# Altium project GANDHVEDH_Ammonia.PrjPcb
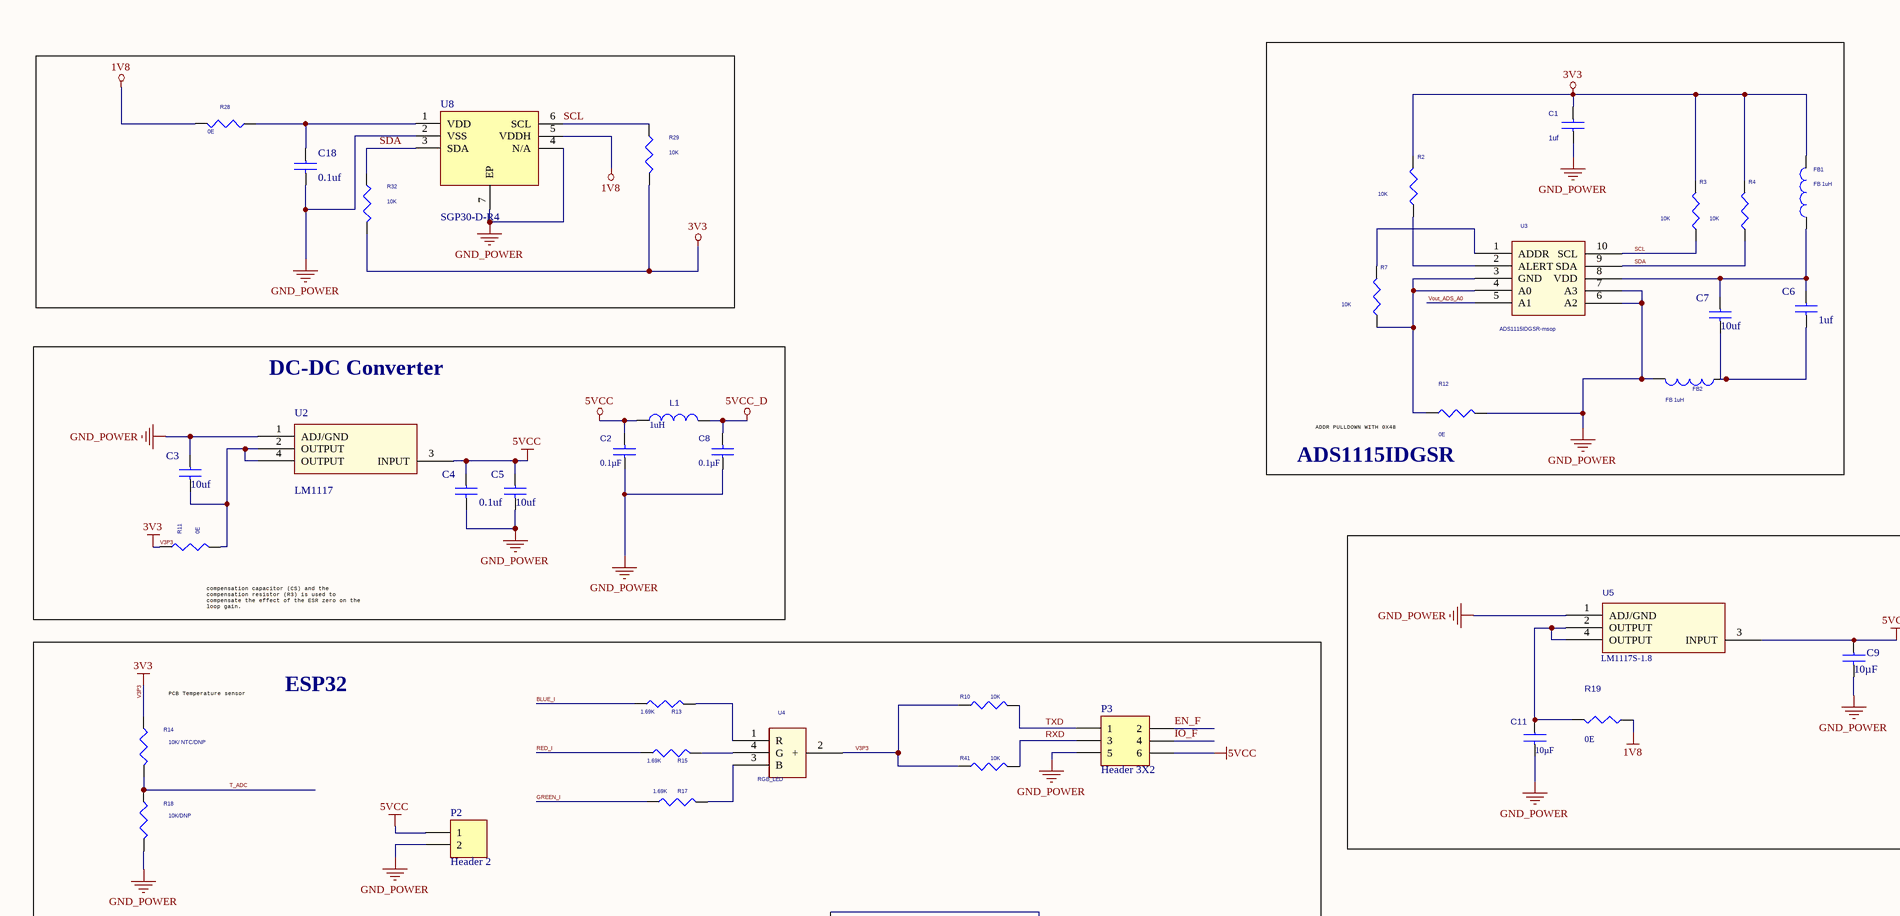
[diagram p0: GANDHVEDH_Ammonia.SchDoc, top left]
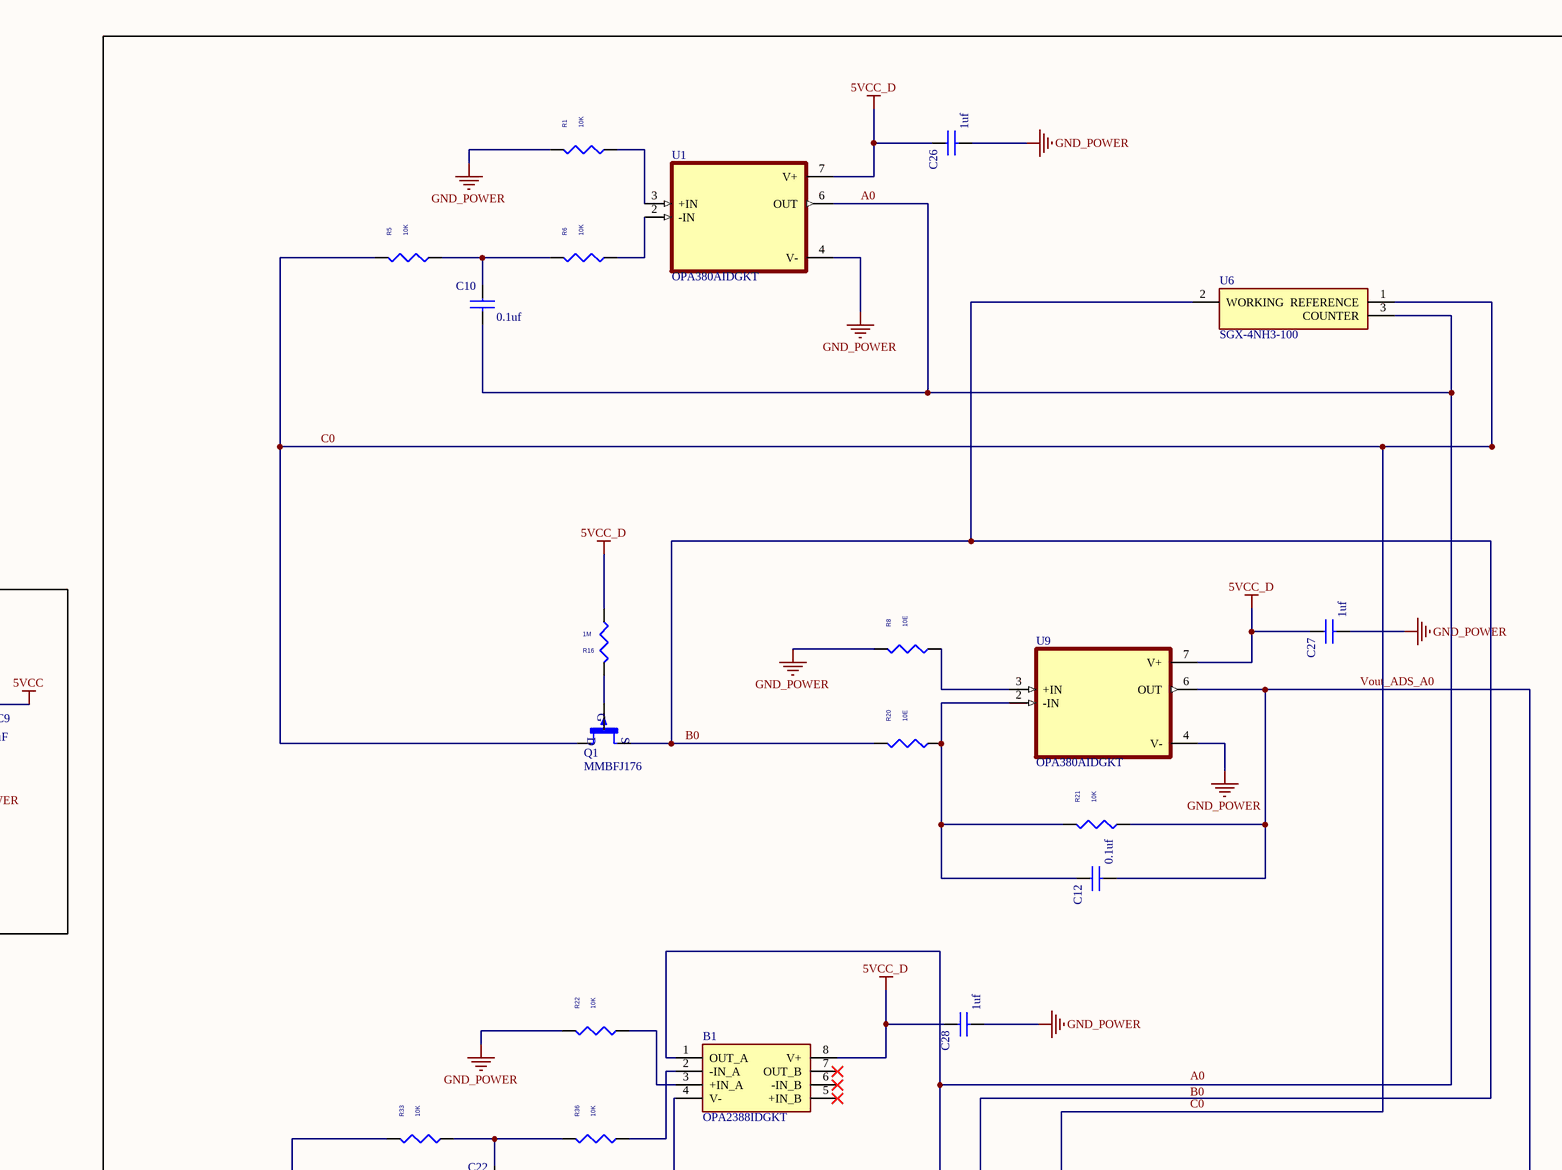
[diagram p1: GANDHVEDH_Ammonia.SchDoc, top right]
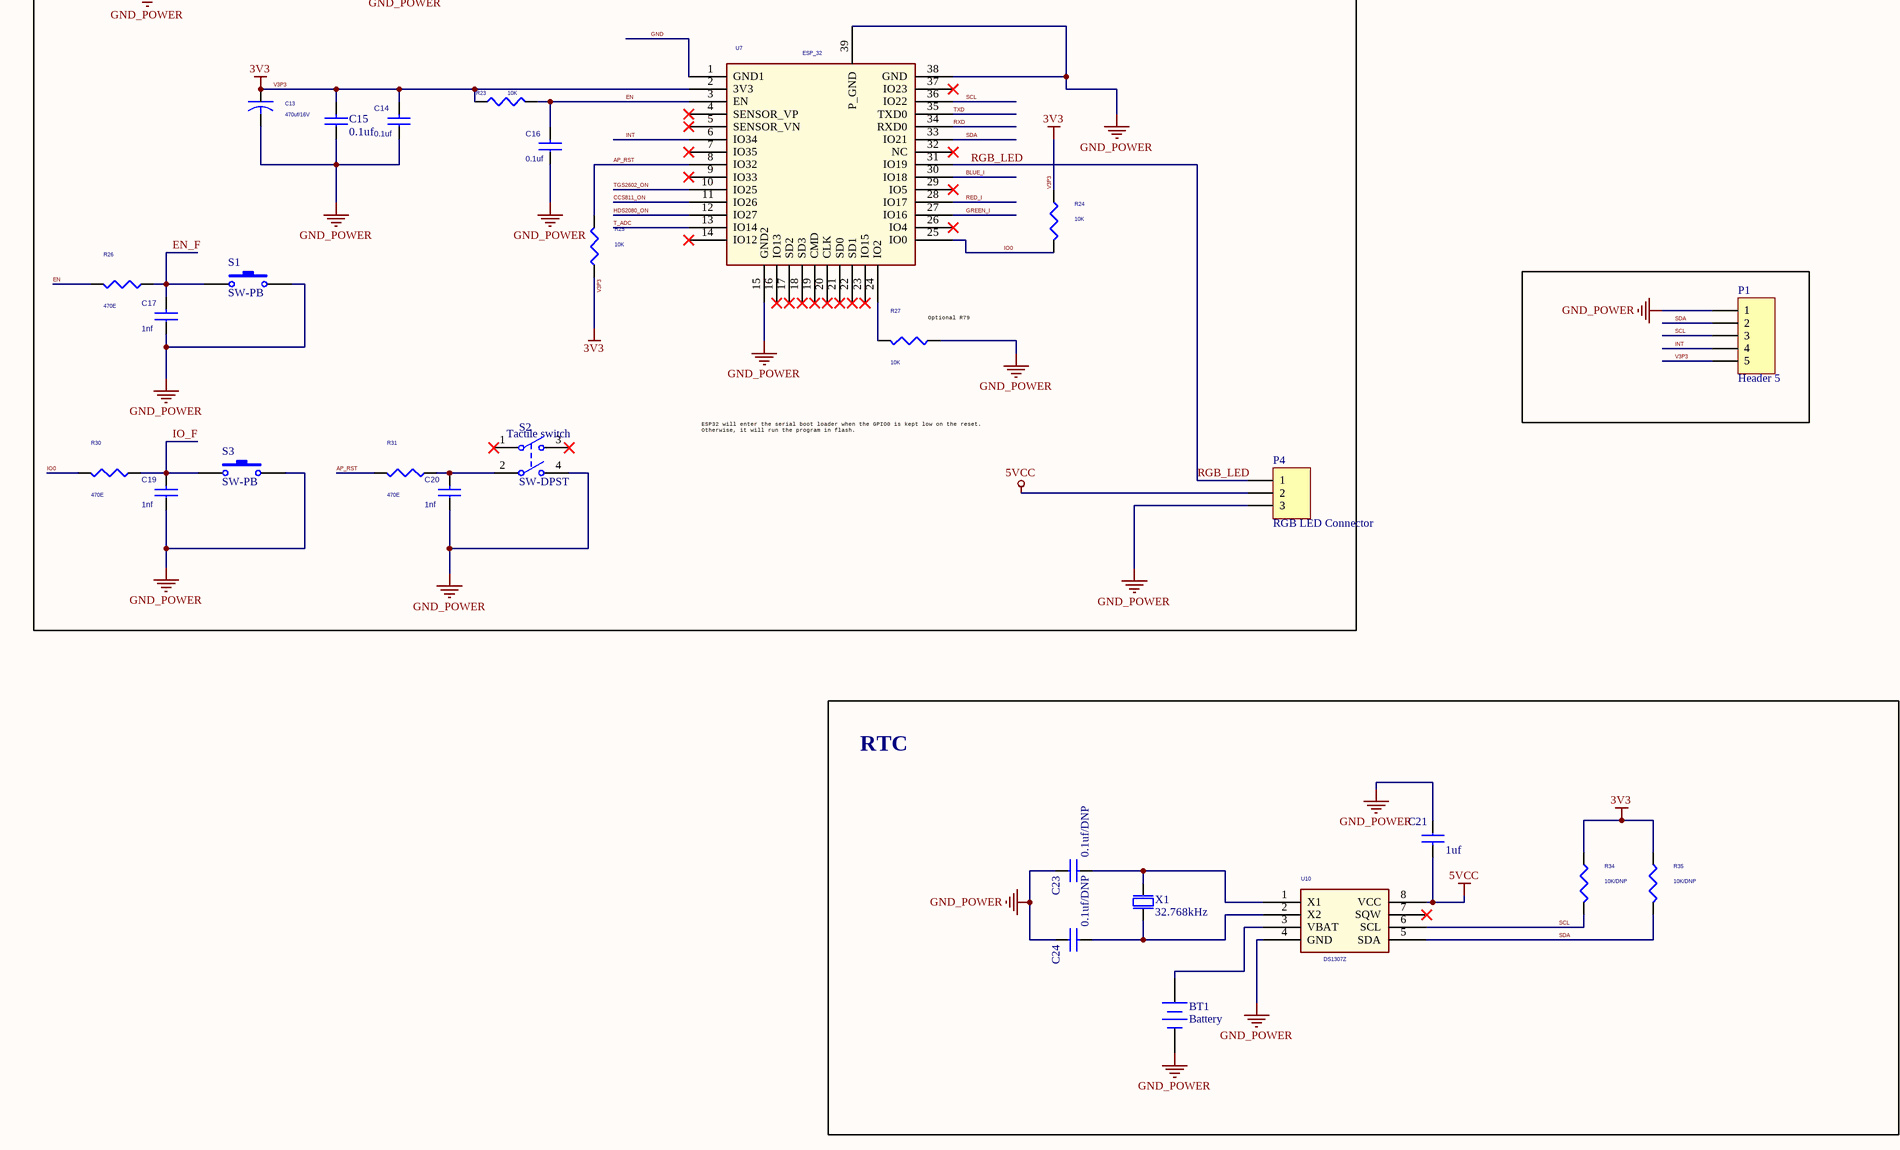
[diagram p2: GANDHVEDH_Ammonia.SchDoc, bottom left]
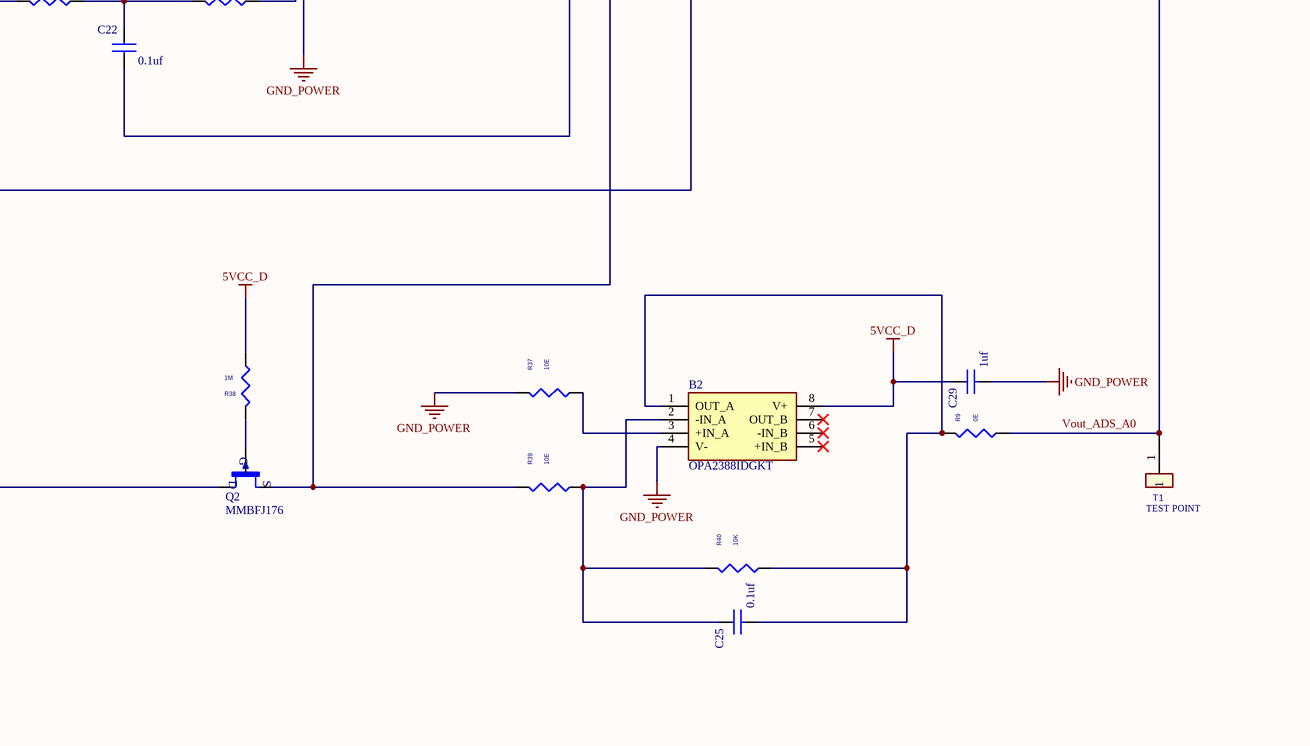
[diagram p3: GANDHVEDH_Ammonia.SchDoc, bottom right]
1 sheet, 97 parts. Net scope: global (net labels, ports and power ports of the same name join across sheets).
Board file: GANDHVEDH_Ammonia.PcbDoc

## Sheet GANDHVEDH_Ammonia.SchDoc
size D

### Parts
B1  OPA2388IDGKT  [SOP65P490X110-8N]
B2  OPA2388IDGKT  [SOP65P490X110-8N]
BT1  Battery  [MPD_BK-912-TR]
C1  1uf  [C0603]
C2  0.1µF  [C0603]
C3  10uf  [C0603]
C4  0.1uf  [C0603]
C5  10uf  [C0603]
C6  1uf  [C0603]
C7  10uf  [C0603]
C8  0.1µF  [C0603]
C9  10µF  [R0603]
C10  0.1uf  [C0603]
C11  10µF  [C0603]
C12  0.1uf  [C0603]
C13  470uf/16V  [C16, C49, C58]
C14  0.1uf  [C0603]
C15  0.1uf  [C0603]
C16  0.1uf  [C0603]
C17  1nf  [C0603]
C18  0.1uf  [C0603]
C19  1nf  [C0603]
C20  1nf  [C0603]
C21  1uf  [C0603]
C22  0.1uf  [C0603]
C23  0.1uf/DNP  [C0603]
C24  0.1uf/DNP  [C0603]
C25  0.1uf  [C0603]
C26  1uf  [C0603]
C27  1uf  [C0603]
C28  1uf  [C0603]
C29  1uf  [C0603]
FB1  FB 1uH  [C0603]
FB2  FB 1uH  [C0603]
L1  1uH  [L3, L4, L5, L6, L7]
P1  Header 5  [J2]
P2  Header 2  [HDR1X2]
P3  Header 3X2  [P5 - new]
P4  RGB LED Connector  [P6]
Q1  MMBFJ176  [SOT23]
Q2  MMBFJ176  [SOT23]
R1  10K  [R0603]
R2  10K  [R0603]
R3  10K  [R0603]
R4  10K  [R0603]
R5  10K  [R0603]
R6  10K  [R0603]
R7  10K  [R0603]
R8  10E  [R0603]
R9  0E  [R0603]
R10  10K  [R_0603_W]
R11  0E  [R0603]
R12  0E  [R0603]
R13  1.69K  [R0603]
R14  10K/ NTC/DNP  [R0603]
R15  1.69K  [R0603]
R16  1M  [R0603]
R17  1.69K  [R0603]
R18  10K/DNP  [R0603]
R19  0E  [R0603]
R20  10E  [R0603]
R21  10K  [R0603]
R22  10K  [R0603]
R23  10K  [R0603]
R24  10K  [R0603]
R25  10K  [R0603]
R26  470E  [R0603]
R27  10K  [R0603]
R28  0E  [R0603]
R29  10K  [R0603]
R30  470E  [R0603]
R31  470E  [R0603]
R32  10K  [R0603]
R33  10K  [R0603]
R34  10K/DNP  [R0603]
R35  10K/DNP  [R0603]
R36  10K  [R0603]
R37  10E  [R0603]
R38  1M  [R0603]
R39  10E  [R0603]
R40  10K  [R0603]
R41  10K  [R_0603_W]
S1  SW-PB  [*TE_FSMSM]
S2  SW-DPST  [PCBComponent_1 - duplicate]
S3  SW-PB  [*TE_FSMSM]
T1  TEST POINT  [TP]
U1  OPA380AIDGKT  [SOP65P490X110-8N]
U2  LM1117  [U1, U24              SOT-223]
U3  ADS1115IDGSR-msop  [U19, U20]
U4  RGB_LED  [WL-SFCW_1206]
U5  LM1117S-1.8  [U1, U24              SOT-223]
U6  SGX-4NH3-100  [SGX4NH3100]
U7  ESP_32  [U20             ESP 32]
U8  SGP30-D-R4  [XCDR_SGP40-D-R4]
U9  OPA380AIDGKT  [SOP65P490X110-8N]
U10  DS1307Z  [U14               SOIC-8N]
X1  32.768kHz  [XTAL_ECS-.327-12.5-13FLX-C]

### Blocks framed on the sheet
ADS1115IDGSR: C1 C6 C7 FB1 FB2 R2-R4 R7 R12 U3
DC-DC Converter: C2-C5 C8 L1 R11 U2
ESP32: C13-C17 C19 C20 P2-P4 R10 R13-R15 R17 R18 R23-R27 R30 R31 R41 S1-S3 U4 U7
RTC: BT1 C21 C23 C24 R34 R35 U10 X1

### Nets
1V8: R19.1 R28.2 U8.5(VDDH)
5VCC: C2.2 C4.1 C5.1 C9.1 C21.2 L1.1 P2.1 P3.6 P4.2 U2.3(INPUT) U5.3(INPUT) U10.8(VCC)
5VCC_D: B1.8(V+) B2.8(V+) C8.2 C26.1 C27.1 C28.1 C29.1 L1.2 R16.1 R38.1 U1.7(V+) U9.7(V+)
GND_POWER: B1.4(V-) B2.4(V-) BT1.2(-) C1.1 C2.1 C3.1 C4.2 C5.2 C8.1 C9.2 C11.2 C13.2 C14.1 C15.1 C16.1 C17.1 C18.2 C19.1 C20.1 C21.1 C23.1 C24.1 C26.2 C27.2 C28.2 C29.2 FB2.2 P1.1 P2.2 P3.5 P4.3 R1.2 R8.2 R12.2 R18.2 R22.2 R27.1 R37.2 S1.2 S2.4(NO2) S3.2 U1.4(V-) U2.1(ADJ/GND) U3.6(A2) U3.7(A3) U5.1(ADJ/GND) U7.15(GND2) U7.38(GND) U7.39(P_GND) U8.2(VSS) U8.4(N/A) U8.7(EP) U9.4(V-) U10.4(GND)
V3P3: C1.2 C13.1 C14.2 C15.2 FB1.2 P1.5 R2.1 R3.1 R4.1 R10.1 R11.1 R14.1 R23.1 R24.1 R25.1 R29.2 R32.2 R34.1 R35.1 R41.1 U4.2(+) U7.2(3V3)  [also labelled 3V3]
A0: B1.1(OUT_A) C10.2 C22.2 U1.6(OUT) U6.3(COUNTER)
AP_RST: R25.2 R31.2 U7.8(IO32)
B0: Q1.2(S) Q2.2(S) R20.2 R39.2 U6.2(WORKING)
BLUE_I: R13.1 U7.30(IO18)
C0: Q1.1(D) Q2.1(D) R5.2 R33.2 U6.1(REFERENCE)
CCS811_ON: U7.11(IO26)
EN: C16.2 R23.2 R26.2 U7.3(EN)
EN_F: C17.2 P3.2 R26.1 S1.1
GND: U7.1(GND1)
GREEN_I: R17.1 U7.27(IO16)
HDS2080_ON: U7.12(IO27)
INT: P1.4 U7.6(IO34)
IO0: R24.2 R30.2 U7.25(IO0)
IO_F: C19.2 P3.4 R30.1 S3.1
RED_I: R15.1 U7.28(IO17)
RGB_LED: P4.1 U7.31(IO19)
RXD: P3.3 R41.2 U7.34(RXD0)
SCL: P1.3 R3.2 R29.1 R34.2 U3.10(SCL) U7.36(IO22) U8.6(SCL) U10.6(SCL)
SDA: P1.2 R4.2 R32.1 R35.2 U3.9(SDA) U7.33(IO21) U8.3(SDA) U10.5(SDA)
T_ADC: R14.2 R18.1 U7.13(IO14)
TGS2602_ON: U7.10(IO25)
TXD: P3.1 R10.2 U7.35(TXD0)
Vout_ADS_A0: C12.2 R9.1 R21.1 T1.1 U3.5(A1) U9.6(OUT)
NetB1_2: B1.2(-IN_A) R36.1
NetB1_3: B1.3(+IN_A) R22.1
NetB2_1: B2.1(OUT_A) C25.2 R9.2 R40.1
NetB2_2: B2.2(-IN_A) C25.1 R39.1 R40.2
NetB2_3: B2.3(+IN_A) R37.1
NetBT1_1: BT1.1(+) U10.3(VBAT)
NetC3_2: C3.2 R11.2 U2.2(OUTPUT) U2.4(OUTPUT)
NetC6_1: C6.1 C7.1 FB1.1 U3.8(VDD)
NetC6_2: C6.2 C7.2 FB2.1
NetC10_1: C10.1 R5.1 R6.2
NetC11_1: C11.1 R19.2 U5.2(OUTPUT) U5.4(OUTPUT)
NetC12_1: C12.1 R20.1 R21.2 U9.2(-IN)
NetC18_1: C18.1 R28.1 U8.1(VDD)
NetC20_2: C20.2 R31.1 S2.2(COMMON2)
NetC22_1: C22.1 R33.1 R36.2
NetC23_2: C23.2 U10.1(X1) X1.1(inp)
NetC24_2: C24.2 U10.2(X2) X1.2(out)
NetQ1_3: Q1.3(G) R16.2
NetQ2_3: Q2.3(G) R38.2
NetR1_1: R1.1 U1.3(+IN)
NetR2_2: R2.2 U3.2(ALERT)
NetR6_1: R6.1 U1.2(-IN)
NetR7_1: R7.1 U3.1(ADDR)
NetR7_2: R7.2 R12.1 U3.3(GND) U3.4(A0)
NetR8_1: R8.1 U9.3(+IN)
NetR13_2: R13.2 U4.1(R)
NetR15_2: R15.2 U4.4(G)
NetR17_2: R17.2 U4.3(B)
NetR27_2: R27.2 U7.24(IO2)

Not connected (* = marked no-connect by the designer): B1 5(+IN_B)* 6(-IN_B)* 7(OUT_B)*; B2 5(+IN_B)* 6(-IN_B)* 7(OUT_B)*; S2 1(COMMON1)* 3(NO1)*; U7 4(SENSOR_VP)* 5(SENSOR_VN)* 7(IO35)* 9(IO33)* 14(IO12)* 16(IO13)* 17(SD2)* 18(SD3)* 19(CMD)* 20(CLK)* 21(SD0)* 22(SD1)* 23(IO15)* 26(IO4)* 29(IO5)* 32(NC)* 37(IO23)*; U10 7(SQW)*

### Notes on the sheet
- ADDR PULLDOWN WITH 0X48
- (near R11) compensation capacitor (CS) and the
  compensation resistor (R3) is used to
  compensate the effect of the ESR zero on the
  loop gain.
- (near R14) PCB Temperature sensor
- (near R27) Optional R79
- (near S2) Tactile switch
- ESP32 will enter the serial boot loader when the GPIO0 is kept low on the reset.
  Otherwise, it will run the program in flash.
- Labels drawn without touching a wire or pin: A0, B0, RGB_LED, Vout_ADS_A0
- Title
- Size:
- Date:
- File:
- D
- Number:
- Time:
- Revision:
- Sheet
- of

### Library data of the parts
B1 B2 = OPA2388IDGKT: 10MHz, CMOS, Zero-Drift, Zero-Crossover, True RRIO Precision Operational Amplifier; Manufacturer_Name: Texas Instruments; Geometry.Height: 1.1mm; Manufacturer_Part_Number: OPA2388IDGKT; Mouser Part Number: 595-OPA2388IDGKT; Mouser Price/Stock: https://www.mouser.co.uk/ProductDetail/Texas-Instruments/OPA2388IDGKT?qs=w%2Fv1CP2dgqqFmz4GVbS77Q%3D%3D; Arrow Part Number: OPA2388IDGKT; Arrow Price/Stock: https://www.arrow.com/en/products/opa2388idgkt/texas-instruments?region=nac; Datasheet Link: http://www.ti.com/general/docs/suppproductinfo.tsp?distId=10&gotoUrl=http%3A%2F%2Fwww.ti.com%2Flit%2Fgpn%2Fopa2388
BT1 = Battery: Multicell Battery; Published: 24-Mar-1999; LatestRevisionDate: 17-Jul-2002; LatestRevisionNote: Re-released for DXP Platform.; PackageReference: BAT-2; Publisher: Altium Limited; PackageDescription: Battery; 2 Leads
C1 = CAP_C_0.1µF/16V: CAP CER SMD 0.1µF/16V; Manufacturer: Murata Electronics North America; Manufacturer Part Number: GRM155R61H104KE19D; Capacitance: 1µF; Tolerance: ±10%; Voltage - Rated: 16V; Temperature Coefficient: X5R; Supplier 1: Digi-Key; Supplier Part Number 1: 490-11917-1-ND; RoHS: RoHS Compliant; Category: Capacitors; Stock 1: 958509; Pricing 1: 1=0.1, 10=0.062, 25=0.0456, 50=0.034, 100=0.0278, 250=0.02328, 500=0.01988, 1000=0.01562, 5000=0.01307 (USD); Packaging: Cut Tape (CT); Part Status: Active; Operating Temperature: -55°C ~ 85°C; Features: -; Ratings: -; Applications: General Purpose; Mounting Type: Surface Mount, MLCC; Package / Case: 0402 (1005 Metric); Size / Dimension: 0.039" L x 0.020" W (1.00mm x 0.50mm); Height - Seated (Max): -; Thickness (Max): 0.022" (0.55mm); Lead Spacing: -; Lead Style: -; ComponentLink1URL: http://www.murata.com/~/media/webrenewal/support/library/catalog/products/capacitor/mlcc/c02e.ashx; ComponentLink1Description: http://www.murata.com/~/media/webrenewal/support/library/catalog/products/capacitor/mlcc/c02e.ashx
C2 C8 C17 C19 C20 = CAP_C_0.1µF/16V: CAP CER SMD 0.1µF/16V; Manufacturer: Murata Electronics North America; Manufacturer Part Number: GRM155R61H104KE19D; Tolerance: ±10%; Voltage - Rated: 16V; Temperature Coefficient: X5R; Supplier 1: Digi-Key; Supplier Part Number 1: 490-11917-1-ND; RoHS: RoHS Compliant; Category: Capacitors; Stock 1: 958509; Pricing 1: 1=0.1, 10=0.062, 25=0.0456, 50=0.034, 100=0.0278, 250=0.02328, 500=0.01988, 1000=0.01562, 5000=0.01307 (USD); Packaging: Cut Tape (CT); Part Status: Active; Operating Temperature: -55°C ~ 85°C; Features: -; Ratings: -; Applications: General Purpose; Mounting Type: Surface Mount, MLCC; Package / Case: 0402 (1005 Metric); Size / Dimension: 0.039" L x 0.020" W (1.00mm x 0.50mm); Height - Seated (Max): -; Thickness (Max): 0.022" (0.55mm); Lead Spacing: -; Lead Style: -; ComponentLink1URL: http://www.murata.com/~/media/webrenewal/support/library/catalog/products/capacitor/mlcc/c02e.ashx; ComponentLink1Description: http://www.murata.com/~/media/webrenewal/support/library/catalog/products/capacitor/mlcc/c02e.ashx
  C2 C8: Capacitance: 0.1µF
  C17 C19 C20: Capacitance: 1nF
C3 C5 C7 = CAP_C_10µF/35V: CAP CER SMD 10µF/35V; Manufacturer: Taiyo Yuden; Manufacturer Part Number: GMK316AB7106KL-TR; Capacitance: 10µF; Tolerance: ±10%; Voltage - Rated: 35V; Temperature Coefficient: X7R; Supplier 1: Digi-Key; Supplier Part Number 1: 587-3007-1-ND; RoHS: RoHS Compliant; Category: Capacitors; Stock 1: 533940; Pricing 1: 1=0.51, 10=0.362, 25=0.3092, 50=0.274, 100=0.2387, 250=0.20328, 500=0.17678, 1000=0.15026 (USD); Packaging: Cut Tape (CT); Part Status: Active; Operating Temperature: -55°C ~ 125°C; Features: -; Ratings: -; Applications: General Purpose; Mounting Type: Surface Mount, MLCC; Package / Case: 1206 (3216 Metric); Size / Dimension: 0.126" L x 0.063" W (3.20mm x 1.60mm); Height - Seated (Max): -; Thickness (Max): 0.071" (1.80mm); Lead Spacing: -; Lead Style: -; ComponentLink1URL: http://www.yuden.co.jp/productdata/catalog/en/mlcc06_e.pdf; ComponentLink1Description: http://www.yuden.co.jp/productdata/catalog/en/mlcc06_e.pdf
C4 C23 C24 = CAP_C_0.1µF/50V: CAP CER SMD 0.1µF/50V; Manufacturer: Yageo; Manufacturer Part Number: CC0805ZRY5V9BB104; Capacitance: 0.1µF; Tolerance: -20%, +80%; Voltage - Rated: 50V; Temperature Coefficient: Y5V (F); Supplier 1: Digi-Key; Supplier Part Number 1: 311-1361-1-ND; RoHS: RoHS Compliant; Category: Capacitors; Stock 1: 934185; Pricing 1: 1=0.1, 10=0.036, 25=0.0264, 50=0.0198, 100=0.0162, 250=0.01352, 500=0.01156, 1000=0.00908 (USD); Packaging: Cut Tape (CT); Part Status: Active; Operating Temperature: -30°C ~ 85°C; Features: -; Ratings: -; Applications: General Purpose; Failure Rate: -; Mounting Type: Surface Mount, MLCC; Package / Case: 0805 (2012 Metric); Size / Dimension: 0.079" L x 0.049" W (2.00mm x 1.25mm); Height - Seated (Max): -; Thickness (Max): 0.024" (0.60mm); Lead Spacing: -; Lead Style: -; ComponentLink1URL: http://www.yageo.com/documents/recent/UPY-GPHC_Y5V_6.3V-to-50V_8.pdf; ComponentLink1Description: http://www.yageo.com/documents/recent/UPY-GPHC_Y5V_6.3V-to-50V_8.pdf
C6 C10 C12 C18 C21 C22 C25-C29 = CAP_C_0.1µF/50V: CAP CER SMD 0.1µF/50V; Manufacturer: Yageo; Manufacturer Part Number: CC0805ZRY5V9BB104; Capacitance: 1µF; Tolerance: -20%, +80%; Voltage - Rated: 50V; Temperature Coefficient: Y5V (F); Supplier 1: Digi-Key; Supplier Part Number 1: 311-1361-1-ND; RoHS: RoHS Compliant; Category: Capacitors; Stock 1: 934185; Pricing 1: 1=0.1, 10=0.036, 25=0.0264, 50=0.0198, 100=0.0162, 250=0.01352, 500=0.01156, 1000=0.00908 (USD); Packaging: Cut Tape (CT); Part Status: Active; Operating Temperature: -30°C ~ 85°C; Features: -; Ratings: -; Applications: General Purpose; Failure Rate: -; Mounting Type: Surface Mount, MLCC; Package / Case: 0805 (2012 Metric); Size / Dimension: 0.079" L x 0.049" W (2.00mm x 1.25mm); Height - Seated (Max): -; Thickness (Max): 0.024" (0.60mm); Lead Spacing: -; Lead Style: -; ComponentLink1URL: http://www.yageo.com/documents/recent/UPY-GPHC_Y5V_6.3V-to-50V_8.pdf; ComponentLink1Description: http://www.yageo.com/documents/recent/UPY-GPHC_Y5V_6.3V-to-50V_8.pdf
C9 C11 = CAP_C_10µF/35V: CAP CER SMD 10µF/35V; Manufacturer: Taiyo Yuden; Manufacturer Part Number: GMK316AB7106KL-TR; Tolerance: ±10%; Voltage - Rated: 35V; Temperature Coefficient: X7R; Supplier 1: Digi-Key; Supplier Part Number 1: 587-3007-1-ND; RoHS: RoHS Compliant; Category: Capacitors; Stock 1: 533940; Pricing 1: 1=0.51, 10=0.362, 25=0.3092, 50=0.274, 100=0.2387, 250=0.20328, 500=0.17678, 1000=0.15026 (USD); Packaging: Cut Tape (CT); Part Status: Active; Capacitance: 10µF; Operating Temperature: -55°C ~ 125°C; Features: -; Ratings: -; Applications: General Purpose; Mounting Type: Surface Mount, MLCC; Package / Case: 1206 (3216 Metric); Size / Dimension: 0.126" L x 0.063" W (3.20mm x 1.60mm); Height - Seated (Max): -; Thickness (Max): 0.071" (1.80mm); Lead Spacing: -; Lead Style: -; ComponentLink1URL: http://www.yuden.co.jp/productdata/catalog/en/mlcc06_e.pdf; ComponentLink1Description: http://www.yuden.co.jp/productdata/catalog/en/mlcc06_e.pdf
C13 = CAP: CAP ALUM 470UF 20% 50V RADIAL; Part Number: 871-B41896E6477M000
C14 C16 = CAP_C_0.1µF/16V: CAP CER SMD 0.1µF/16V; Manufacturer: Murata Electronics North America; Manufacturer Part Number: GRM155R61H104KE19D; Capacitance: 0.1µF; Tolerance: ±10%; Voltage - Rated: 16V; Temperature Coefficient: X5R; Supplier 1: Digi-Key; Supplier Part Number 1: 490-11917-1-ND; RoHS: RoHS Compliant; Category: Capacitors; Stock 1: 958509; Pricing 1: 1=0.1, 10=0.062, 25=0.0456, 50=0.034, 100=0.0278, 250=0.02328, 500=0.01988, 1000=0.01562, 5000=0.01307 (USD); Packaging: Cut Tape (CT); Part Status: Active; Operating Temperature: -55°C ~ 85°C; Features: -; Ratings: -; Applications: General Purpose; Mounting Type: Surface Mount, MLCC; Package / Case: 0402 (1005 Metric); Size / Dimension: 0.039" L x 0.020" W (1.00mm x 0.50mm); Height - Seated (Max): -; Thickness (Max): 0.022" (0.55mm); Lead Spacing: -; Lead Style: -; ComponentLink1URL: http://www.murata.com/~/media/webrenewal/support/library/catalog/products/capacitor/mlcc/c02e.ashx; ComponentLink1Description: http://www.murata.com/~/media/webrenewal/support/library/catalog/products/capacitor/mlcc/c02e.ashx
C15 = CAP_C_10µF/10V: CAP CER SMD 10µF/10V; Manufacturer: Yageo; Manufacturer Part Number: CC0805ZKY5V6BB106; Capacitance: 10µF; Tolerance: -20%, +80%; Voltage - Rated: 10V; Temperature Coefficient: Y5V (F); Supplier 1: Digi-Key; Supplier Part Number 1: 311-1355-1-ND; RoHS: RoHS Compliant; Category: Capacitors; Stock 1: 595702; Pricing 1: 1=0.18, 10=0.131, 25=0.0956, 50=0.0742, 100=0.0615, 250=0.05088, 500=0.04312, 1000=0.03569 (USD); Packaging: Cut Tape (CT); Part Status: Active; Operating Temperature: -30°C ~ 85°C; Features: -; Ratings: -; Applications: General Purpose; Failure Rate: -; Mounting Type: Surface Mount, MLCC; Package / Case: 0805 (2012 Metric); Size / Dimension: 0.079" L x 0.049" W (2.00mm x 1.25mm); Height - Seated (Max): -; Thickness (Max): 0.049" (1.25mm); Lead Spacing: -; Lead Style: -; ComponentLink1URL: http://www.yageo.com/documents/recent/UPY-GPHC_Y5V_6.3V-to-50V_8.pdf; ComponentLink1Description: http://www.yageo.com/documents/recent/UPY-GPHC_Y5V_6.3V-to-50V_8.pdf
FB1 FB2 = INDUCTOR: FILTER CHIP 120 OHM 3A 0603; Manufacturer Part Number: MMZ2012Y152B; Type: Ferrite; Package: 0603; Distributor Part Number: MMZ2012Y152B; Part Number: MMZ2012Y152B
L1 = INDUCTOR: FERRITE BEAD 120 OHM 0603 1LN; Part Number: 490-3996-1-ND; Supplier 1: Arrow; Supplier Part Number 1: BLM18SG121TN1D
P1 = Header 5: Header, 5-Pin; LatestRevisionDate: 17-Jul-2002; LatestRevisionNote: Re-released for DXP Platform.; Publisher: Altium Limited
P2 = Header 2: Header, 2-Pin; LatestRevisionDate: 17-Jul-2002; LatestRevisionNote: Re-released for DXP Platform.; Publisher: Altium Limited
P3 = Header 3X2: Header, 3-Pin, Dual row; LatestRevisionDate: 17-Jul-2002; LatestRevisionNote: Re-released for DXP Platform.; Publisher: Altium Limited
P4 = Header 3: Header, 3-Pin; LatestRevisionDate: 17-Jul-2002; LatestRevisionNote: Re-released for DXP Platform.; Publisher: Altium Limited
Q1 Q2 = MMBFJ176: JFET P-Channel 30V 225mW Surface Mount SOT-23-3; MF: ON Semiconductor; Purchase-URL: https://pricing.snapeda.com/search/part/MMBFJ176/?ref=eda; MP: MMBFJ176; Package: SOT-23-3 ON Semiconductor; Price: None; Availability: Good; SnapEDA_Link: https://www.snapeda.com/parts/MMBFJ176/ON%20Semiconductor/view-part/2239418/?ref=snap; Value: *; Check_prices: https://www.snapeda.com/parts/MMBFJ176/ON%20Semiconductor/view-part/2239418/?ref=eda
R1 R5 R6 R8 R9 R12 R16 R20-R22 R33 R36-R40 = R: Type: Resistor; Package: 0603
R2-R4 R7 = R: RES SMD 4.7K OHM 1% 1/16W 0603; Manufacturer Part Number: 1276-3466-2-ND; Manufacturer: Samsung; Part Number: 311-10KGRTR-ND; Type: Resistor; Rating: 1/16W; Tolerance: 1%; Distributor: Digikey; Distributor Part Number: 1276-3466-2-ND; Package: 0603
R10 R13 R15 R17 R18 R23-R25 R27-R29 R32 R34 R35 R41 = R: RES SMD 4.7K OHM 1% 1/16W 0603; Part Number: 311-10KGRTR-ND; Package: 0603; Type: Resistor
R11 = R: RES SMD 40.2K OHM 0.1% 1/5W 0603; Part Number: P20154TR-ND; Type: Resistor; Package: 0603
R14 = R: THERMISTOR NTC 10KOHM 3380K 0603; Part Number: 490-16279-2-ND; Type: Resistor; Package: 0603
R19 R26 R30 R31 = R: RES SMD 470 OHM 1% 1/10W 0603; Part Number: 311-470HRCT-ND; Type: Resistor; Package: 0603
S1 S3 = SW-PB: Switch; Published: 24-Mar-1999; LatestRevisionDate: 17-Jul-2002; LatestRevisionNote: Re-released for DXP Platform.; PackageReference: SPST-2; Publisher: Altium Limited; PackageDescription: Switch; 2 Leads
S2 = SW-DPST: Double-Pole, Single-Throw Switch; Published: 24-Mar-1999; LatestRevisionDate: 17-Jul-2002; LatestRevisionNote: Re-released for DXP Platform.; PackageReference: DPST-4; Publisher: Altium Limited; PackageDescription: Switch; 4 Leads
T1 = Test_P
U2 = TLV70033DDCT: 3.3V LDO; Manufacturer: Texas Instruments; Regulator Topology: Positive Fixed; Current - Output: 200mA; Voltage - Input: Up to 5.5V; Current - Limit (Min): 220mA; Supplier 1: Digi-Key; Supplier Part Number 1: 296-25276-1-ND; Manufacturer Part Number: LM1117; RoHS: RoHS Compliant; Category: Integrated Circuits (ICs); Stock 1: 5021; Pricing 1: 1=0.53, 10=0.452, 100=0.3374 (USD); Packaging: Cut Tape (CT); Part Status: Active; Voltage - Output: 3.3V; Voltage - Dropout (Typical): -; Operating Temperature: -40°C ~ 125°C; Mounting Type: Surface Mount; Package / Case: SOT-23-5 Thin, TSOT-23-5; Supplier Device Package: SOT-23-5; ComponentLink1URL: http://www.ti.com/lit/ds/slvsa00e/slvsa00e.pdf; ComponentLink1Description: http://www.ti.com/lit/ds/slvsa00e/slvsa00e.pdf
U3 = ADS1115: IC ADC 16BIT SIGMA-DELTA 10VSSOP; Part Number: 595-ADS1115IDGST
U4 = RGB_LED_PTH_0: Part Number: 754-1492-ND
U5 = TLV70033DDCT: 3.3V LDO; Manufacturer: Texas Instruments; Manufacturer Part Number: LM1117; Regulator Topology: Positive Fixed; Current - Output: 200mA; Voltage - Input: Up to 5.5V; Current - Limit (Min): 220mA; RoHS: RoHS Compliant; Category: Integrated Circuits (ICs); Stock 1: 5021; Pricing 1: 1=0.53, 10=0.452, 100=0.3374 (USD); Packaging: Cut Tape (CT); Part Status: Active; Voltage - Output: 3.3V; Voltage - Dropout (Typical): -; Operating Temperature: -40°C ~ 125°C; Mounting Type: Surface Mount; Package / Case: SOT-23-5 Thin, TSOT-23-5; Supplier Device Package: SOT-23-5; ComponentLink1URL: http://www.ti.com/lit/ds/slvsa00e/slvsa00e.pdf; ComponentLink1Description: http://www.ti.com/lit/ds/slvsa00e/slvsa00e.pdf; Supplier 1: Digi-Key; Supplier Part Number 1: LM1117IMP-3.3/NOPBCT-ND
U6 = SGX-4NH3-100: Air Quality Sensors 4 Series Ammonia sensor - 100ppm; Manufacturer_Name: Amphenol; Geometry.Height: 16.65mm; Manufacturer_Part_Number: SGX-4NH3-100; Mouser Part Number: 523-SGX-4NH3-100; Mouser Price/Stock: https://www.mouser.co.uk/ProductDetail/Amphenol-SGX-Sensortech/SGX-4NH3-100?qs=GedFDFLaBXEqY8NJ5Ztffw%3D%3D; Arrow Part Number: *; Arrow Price/Stock: *; Datasheet Link: https://sgx.cdistore.com/datasheets/sgx/ds-0329-sgx-4nh3-100-datasheet.pdf
U7 = ESP32_SMD_1: WIFI MODULE 128MBITS SPI FLASH; Part Number: 356-ES32WROOM32D16MB
U8 = SGP40-D-R4: Integrated Circuit; Manufacturer_Name: Sensirion; Datasheet Link: https://www.mouser.com/datasheet/2/682/Sensirion_Gas_Sensors_SGP40_Datasheet-1888696.pdf; Height: 0.95mm; Manufacturer_Part_Number: SGP40-D-R4; Mouser Part Number: 403-SGP40-D-R4; Mouser Price/Stock: https://www.mouser.co.uk/ProductDetail/Sensirion/SGP40-D-R4?qs=yqaQSyyJnNgaRqiZfsbS1Q%3D%3D; Arrow Part Number: SGP40-D-R4; Arrow Price/Stock: https://www.arrow.com/en/products/sgp40-d-r4/sensirion-ag?region=europe
U10 = MP1584_SOIC_0: IC REG BUCK ADJUSTABLE 3A 8SOIC; Part Number: 1589-1533-1-ND
X1 = XTAL_2-pin: XTAL SMD 3215, 32.768kHz, Cl=9pF, Total Tol: ±50ppm; Part Number: XTAL_SMD3215_32.768kHz_9pF_General; Note: XTAL SMD 32.768kHz; Artikkelnr Noca: N.A.; Manufacturer: *; Manufacturer Part Number: *; Datasheet: *; LatestRevisionDate: 2016-08-19; Pin Count: 2; Publisher: Nordic Semiconductor; Published: 2016-08-19; Value: 32.768kHz; Supplier: *; Supplier part number: *; 2nd source Supplier: *; 2nd source part number: *; Footprint Doc: XTAL_3215; Artikkelnr Simpro: N.A.
U1 U9 = OPA380AIDGKT: Package: None; Price: None; Value: *; MP: OPA380AIDGKT; Availability: Unavailable